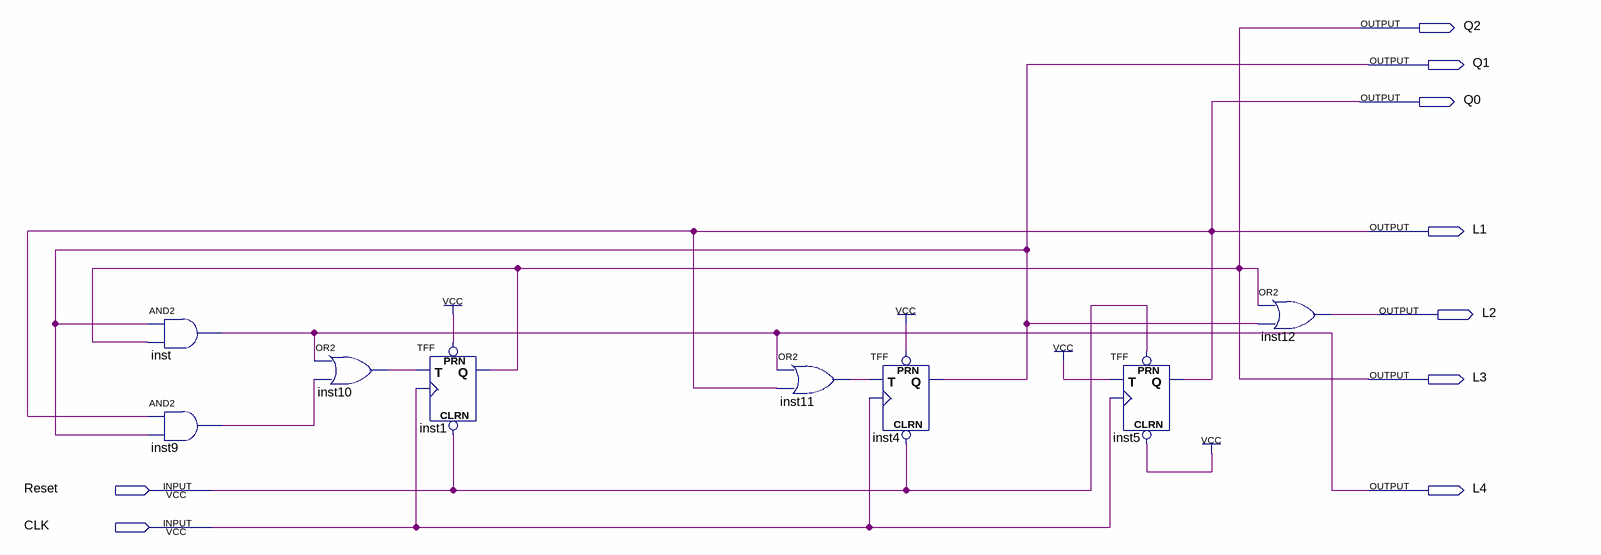
[diagram p0: schematic sheet]
// Quartus schematic ex1_2.bdf as structural Verilog: 8 symbols, 9 pins
module ex1_2 (
  input  Reset,
  input  CLK,
  output Q2,
  output Q1,
  output Q0,
  output L1,
  output L2,
  output L3,
  output L4
);

  wire inst9_out, inst10_out, inst11_out;

  and inst (L4, Q1, L3);
  and inst9 (inst9_out, L1, Q1);
  or inst10 (inst10_out, L4, inst9_out);
  TFF inst1 (.PRN(1'b1), .CLRN(Reset), .T(inst10_out), .CLK(CLK), .Q(L3));
  or inst11 (inst11_out, L4, L1);
  TFF inst4 (.PRN(1'b1), .CLRN(Reset), .T(inst11_out), .CLK(CLK), .Q(Q1));
  TFF inst5 (.PRN(Reset), .CLRN(1'b1), .T(1'b1), .CLK(CLK), .Q(L1));
  or inst12 (L2, L3, Q1);

  assign Q0 = L1;
  assign Q2 = L3;
endmodule
